# EAGLE design Interface (EAGLE 9.6.2)
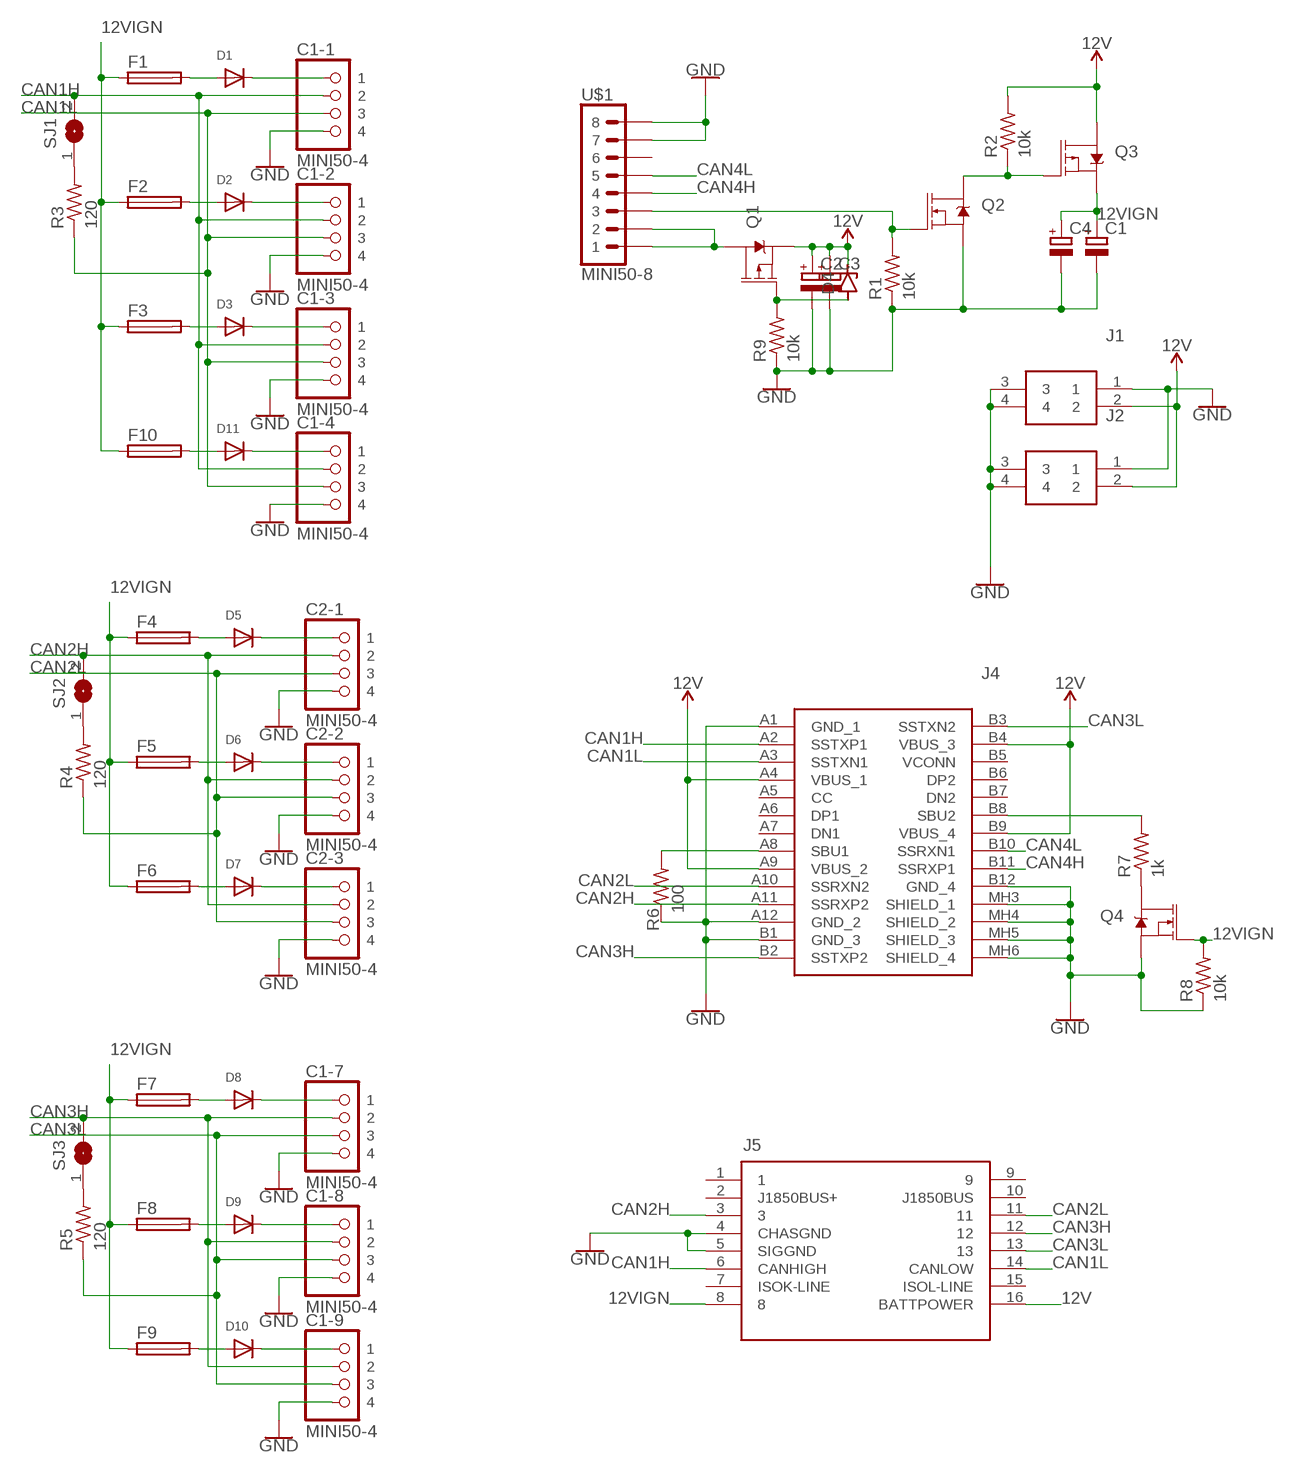
[diagram p0: schematic, sheet 1]

## Parts
C1  CPOL-EU153CLV-1010  [153CLV-1010]
C1-1  MINI50-4  [MINI50]
C1-2  MINI50-4  [MINI50]
C1-3  MINI50-4  [MINI50]
C1-4  MINI50-4  [MINI50]
C1-7  MINI50-4  [MINI50]
C1-8  MINI50-4  [MINI50]
C1-9  MINI50-4  [MINI50]
C2  CPOL-EU153CLV-1010  [153CLV-1010]
C2-1  MINI50-4  [MINI50]
C2-2  MINI50-4  [MINI50]
C2-3  MINI50-4  [MINI50]
C3  CPOL-EU153CLV-0505  [153CLV-0505]
C4  CPOL-EU153CLV-0505  [153CLV-0505]
D1  DIODESOD-323F  [SOD-323F]
D2  DIODESOD-323F  [SOD-323F]
D3  DIODESOD-323F  [SOD-323F]
D4  ZENER_DO-219-AB(SOD123F)  [SODFL3718X115]
D5  DIODESOD-323F  [SOD-323F]
D6  DIODESOD-323F  [SOD-323F]
D7  DIODESOD-323F  [SOD-323F]
D8  DIODESOD-323F  [SOD-323F]
D9  DIODESOD-323F  [SOD-323F]
D10  DIODESOD-323F  [SOD-323F]
D11  DIODESOD-323F  [SOD-323F]
F1  FUSE_CHIP-1206(3216-METRIC)  [FUSC3215X82N]
F2  FUSE_CHIP-1206(3216-METRIC)  [FUSC3215X82N]
F3  FUSE_CHIP-1206(3216-METRIC)  [FUSC3215X82N]
F4  FUSE_CHIP-1206(3216-METRIC)  [FUSC3215X82N]
F5  FUSE_CHIP-1206(3216-METRIC)  [FUSC3215X82N]
F6  FUSE_CHIP-1206(3216-METRIC)  [FUSC3215X82N]
F7  FUSE_CHIP-1206(3216-METRIC)  [FUSC3215X82N]
F8  FUSE_CHIP-1206(3216-METRIC)  [FUSC3215X82N]
F9  FUSE_CHIP-1206(3216-METRIC)  [FUSC3215X82N]
F10  FUSE_CHIP-1206(3216-METRIC)  [FUSC3215X82N]
J1  34912-8020  [0349128020]
J2  34912-8020  [0349128020]
J4  632722110112  [632722110112]
J5  OBDII-FEMALEFEMALE  [OBDII-FEMALE]
Q1  6.5A/20V/35mΩ  MOSFET_PCH-KI4435DY  [SO08]
Q2  5.8A/30V/35mΩ  MOSFET-NCH-AO3404A  [SOT23-3]
Q3  6.5A/20V/35mΩ  MOSFET_PCH-KI4435DY  [SO08]
Q4  5.8A/30V/35mΩ  MOSFET-NCH-AO3404A  [SOT23-3]
R1  10k  R0402  [0402-R]
R2  10k  R0402  [0402-R]
R3  120  R0402  [0402-R]
R4  120  R0402  [0402-R]
R5  120  R0402  [0402-R]
R6  100  R0402  [0402-R]
R7  1k  R0402  [0402-R]
R8  10k  R0402  [0402-R]
R9  10k  R0402  [0402-R]
SJ1  SJ  [SJ]
SJ2  SJ  [SJ]
SJ3  SJ  [SJ]
U$1  MINI50-8  [MINI50-8]

## Nets
12V: C2.+ C3.+ D4.2(C) J1.2 J2.2 J4.A4(VBUS_1) J4.A9(VBUS_2) J4.B4(VBUS_3) J4.B9(VBUS_4) J5.16(BATTPOWER) Q1.1(S) Q1.2(S) Q1.3(S) Q3.5(D) Q3.6(D) Q3.7(D) Q3.8(D) R2.2
12VIGN: C1.+ C4.+ F1.1 F2.1 F3.1 F4.1 F5.1 F6.1 F7.1 F8.1 F9.1 F10.1 J5.8 Q3.1(S) Q3.2(S) Q3.3(S) Q4.1(G) R8.2
CAN1H: C1-1.3 C1-2.3 C1-3.3 C1-4.3 J4.A2(SSTXP1) J5.6(CANHIGH) SJ1.2
CAN1L: C1-1.2 C1-2.2 C1-3.2 C1-4.2 J4.A3(SSTXN1) J5.14(CANLOW) R3.1
CAN2H: C2-1.3 C2-2.3 C2-3.3 J4.A11(SSRXP2) J5.3 SJ2.2
CAN2L: C2-1.2 C2-2.2 C2-3.2 J4.A10(SSRXN2) J5.11 R4.1
CAN3H: C1-7.3 C1-8.3 C1-9.3 J4.B2(SSTXP2) J5.12 SJ3.2
CAN3L: C1-7.2 C1-8.2 C1-9.2 J4.B3(SSTXN2) J5.13 R5.1
CAN4H: J4.B11(SSRXP1) U$1.P$4
CAN4L: J4.B10(SSRXN1) U$1.P$5
GND: C1-1.1 C1-2.1 C1-3.1 C1-4.1 C1-7.1 C1-8.1 C1-9.1 C1.- C2-1.1 C2-2.1 C2-3.1 C2.- C3.- C4.- J1.1 J1.3 J1.4 J2.1 J2.3 J2.4 J4.A1(GND_1) J4.A12(GND_2) J4.B1(GND_3) J4.B12(GND_4) J4.MH3(SHIELD_1) J4.MH4(SHIELD_2) J4.MH5(SHIELD_3) J4.MH6(SHIELD_4) J5.4(CHASGND) J5.5(SIGGND) Q2.2(S) Q4.2(S) R1.1 R6.1 R8.1 R9.1 U$1.P$7 U$1.P$8
N$1: D1.A F1.2
N$2: C1-1.4 D1.C
N$3: D2.A F2.2
N$4: C1-2.4 D2.C
N$5: D3.A F3.2
N$6: C1-3.4 D3.C
N$7: R3.2 SJ1.1
N$8: D5.A F4.2
N$9: C2-1.4 D5.C
N$10: Q1.5(D) Q1.6(D) Q1.7(D) Q1.8(D) U$1.P$1 U$1.P$2
N$11: D6.A F5.2
N$12: Q2.1(G) R1.2 U$1.P$3
N$13: C2-2.4 D6.C
N$14: D7.A F6.2
N$15: Q2.3(D) Q3.4(G) R2.1
N$16: C2-3.4 D7.C
N$17: R4.2 SJ2.1
N$18: D8.A F7.2
N$19: C1-7.4 D8.C
N$20: D9.A F8.2
N$21: C1-8.4 D9.C
N$22: D10.A F9.2
N$23: C1-9.4 D10.C
N$24: R5.2 SJ3.1
N$25: J4.B8(SBU2) R7.2
N$26: D4.1(A) Q1.4(G) R9.2
N$27: D11.A F10.2
N$28: C1-4.4 D11.C
N$29: Q4.3(D) R7.1
N$30: J4.A8(SBU1) R6.2
Unconnected: J4.A5(CC) J4.A6(DP1) J4.A7(DN1) J4.B5(VCONN) J4.B6(DP2) J4.B7(DN2) J5.1 J5.2(J1850BUS+) J5.7(ISOK-LINE) J5.9 J5.10(J1850BUS) J5.15(ISOL-LINE) U$1.P$6

## Library data of the parts
C1-C4 = rcl:CPOL-EU: POLARIZED CAPACITOR, European symbol; SPICEPREFIX: C
C1-1-C1-4 C1-7-C1-9 C2-1-C2-3 = interceptor:MINI50-4
D1-D3 D5-D11 = adafruit:DIODE: Diode SMADIODE - SMA Surface Mount Package 20V 1A Schottky Diode Digikey: 641-1014-6-ND DO-1N4148 - Through Hole Small Current Diode SOD-123 20V 1 A (.5mV Vf) Schottky Diode - Digikey: MBRX120TPMSCT-ND SOD-323 10V 570mA (.38mV Vf, 3ns) Schottky Diode - Digikey: ZLLS410CT-ND SOD-523 30V 30mA Schottky Diode (RB751S-40TE61) - Digikey: RB751S-40TE61CT-ND SOT23-R/W - SOT23 Package (R = Solder Paste/Reflow Ovens, W = Hand-Soldering) BAT54Film 40V 300mA - Digikey: 497-7162-1-ND
D4 = Diode:ZENER: Zener Diode - Generic; CATEGORY: Diode; SUB-CATEGORY: Zener
F1-F10 = Circuit-Protection:FUSE: Fuse - Generic; CATEGORY: Circuit-Protection; SUB-CATEGORY: Fuse
J1 J2 = SamacSys_Parts:34912-8020: Molex Mini50 Series, 34912 Series Number, 1 Row 2 Way Surface Mount Plug PCB Header, with SMT Termination Method Source: Datasheet <https://www.molex.com/pdm_docs/sd/349128020_sd.pdf>; DESCRIPTION: Molex Mini50 Series, 34912 Series Number, 1 Row 2 Way Surface Mount Plug PCB Header, with SMT Termination Method; HEIGHT: 9mm; MANUFACTURER_NAME: Molex; MANUFACTURER_PART_NUMBER: 34912-8020; MOUSER_PART_NUMBER: 538-34912-8020; MOUSER_PRICE-STOCK: https://www.mouser.co.uk/ProductDetail/Molex/34912-8020?qs=jj7GbYRQuObyP9O5PVDUYw%3D%3D
J4 = SamacSys_Parts:632722110112: USB Connectors WR-COM SMT Vertical Black Source: Datasheet; DESCRIPTION: USB Connectors WR-COM SMT Vertical Black; HEIGHT: 7.4mm; MANUFACTURER_NAME: Wurth Elektronik; MANUFACTURER_PART_NUMBER: 632722110112; MOUSER_PART_NUMBER: 710-632722110112; MOUSER_PRICE-STOCK: https://www.mouser.co.uk/ProductDetail/Wurth-Elektronik/632722110112/?qs=2WXlatMagcH6zbfYjgLonA%3D%3D
J5 = interceptor:OBDII-FEMALE
Q1 Q3 = SparkFun-DiscreteSemi:MOSFET_PCH: P-channel MOSFETs Voltage controlled devices that allow control of high current outputs. SparkFun Products: SparkFun ESP32 Thing <https://www.sparkfun.com/products/13907> SparkFun ESP8266 Thing <https://www.sparkfun.com/products/13231>; PROD_ID: TRANS-08355
Q2 Q4 = SparkFun-DiscreteSemi:MOSFET-NCH: N-channel MOSFETs Voltage controlled devices that allow control of high current outputs. SparkFun Products: SparkFun OpenScale <https://www.sparkfun.com/products/13261> SparkFun Digital Sandbox <https://www.sparkfun.com/products/12651> SparkFun Monster Moto Shield <https://www.sparkfun.com/products/10182> SparkFun MOSFET Power Controller <https://www.sparkfun.com/products/11214>; PROD_ID: TRANS-12988
R1-R9 = interceptor:R
SJ1-SJ3 = jumper:SJ: SMD solder JUMPER
U$1 = interceptor:MINI50-8

## Board
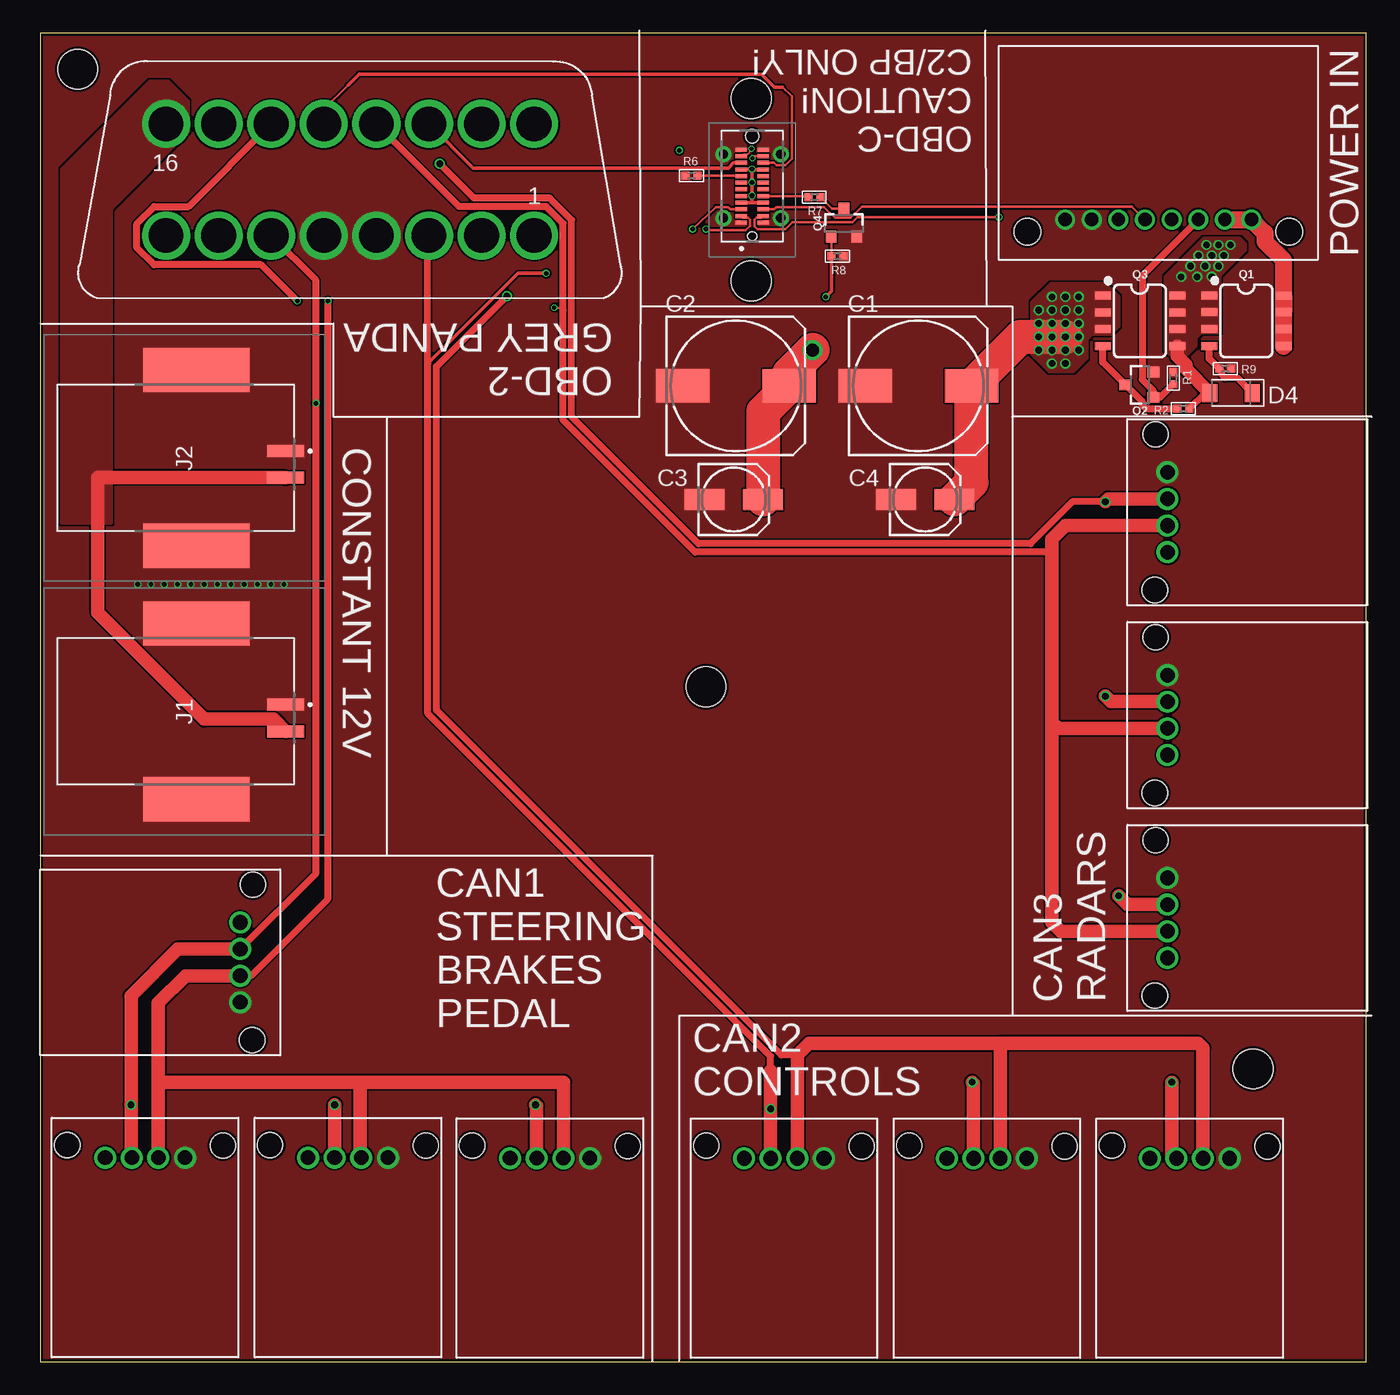
[diagram p1: board, top side]
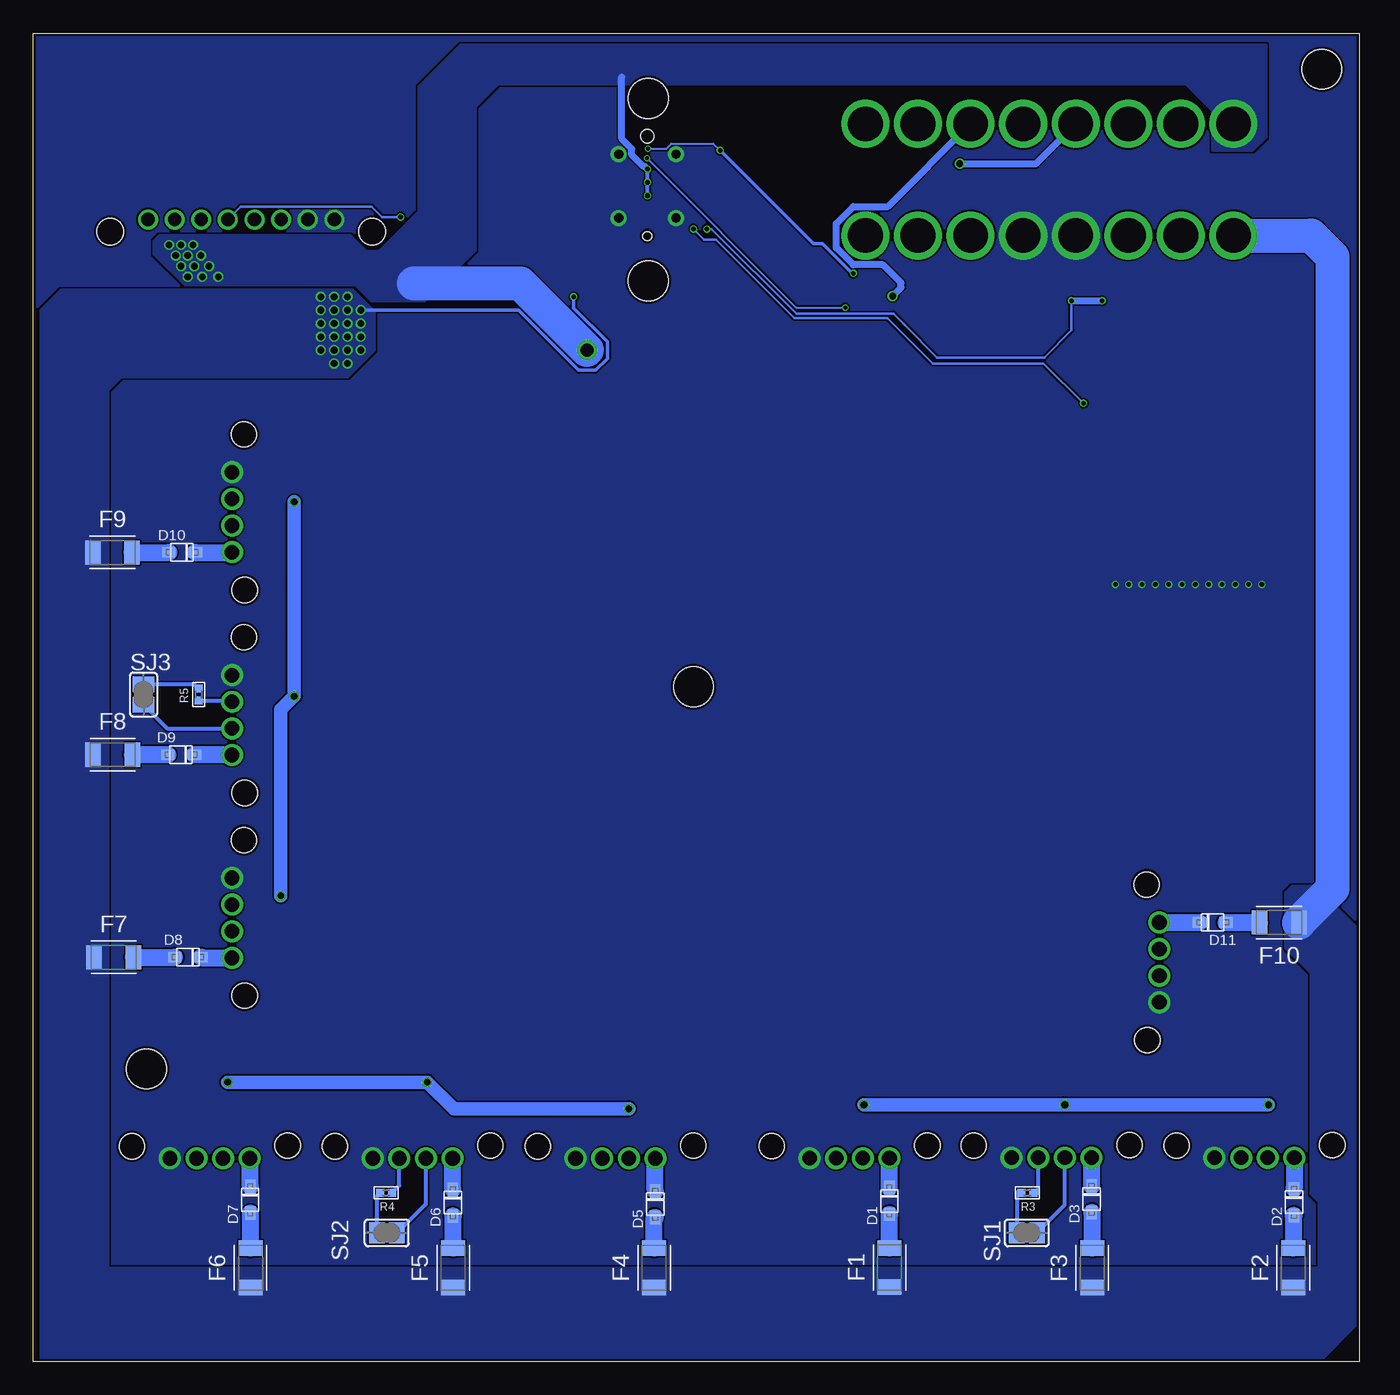
[diagram p2: board, bottom side, seen from below]

Size 99.6 x 99.8 mm. Coordinates in mm from the lower left corner, seen from the top.
Outline: 0,0 99.6,0 99.6,99.8 0,99.8 0,0
Copper layers (1*16): Top 0.035559375mm / dielectric 1.6mm / Bottom 0.035559375mm
Design rules "jlcpcb2layer": minimum track width 5mil, minimum drill 12mil, track to track 5mil, track to pad 5mil, pad to pad 5mil, via to via 5mil, smd to smd 5mil, copper to edge 8mil, drill to drill 6mil, minimum pad ring 5mil, minimum via ring 3mil, stop-mask expansion 2.5mil, vias tented up to drill 0mil, thermal gap 10mil
Holes 3 mm at 53.4,81.2 53.4,94.9 91.1,22 2.8,97.1 50,50.7

### Footprints (pad centres in the part's own frame; a part is rotated, then mirrored left to right if it is on the bottom)
153CLV-1010 = smd 4 x 2.5: + 4,0; - -4,0
MINI50 = drill 1.1: 1 0,0; 2 2,0; 3 4,0; 4 6,0 | hole 1.9: -2.85,-0.9; 8.85,-0.95
153CLV-0505 = smd 3 x 1.6: + 2.2,0; - -2.2,0
SOD-323F = smd 1 x 0.8: A -1,0; C 1,0
SODFL3718X115 = smd 1.115 x 1.361: 1 -1.6,0; 2 1.6,0
FUSC3215X82N = smd 1.165 x 1.814: 1 -1.475,0; 2 1.475,0
0349128020 = smd 0.9 x 2.75: 1 -0.5,6.72; 2 1.5,6.72 | smd 3.32 x 8: 3 -6.59,0; 4 6.61,0
632722110112 = smd 0.3 x 0.85: A1 -2.75,0.83; A2 -2.25,0.83; A3 -1.75,0.83; A4 -1.25,0.83; A5 -0.75,0.83; A6 -0.25,0.83; A7 0.25,0.83; A8 0.75,0.83; A9 1.25,0.83; A10 1.75,0.83; A11 2.25,0.83; A12 2.75,0.83; B1 2.75,-0.83; B2 2.25,-0.83; B3 1.75,-0.83; B4 1.25,-0.83; B5 0.75,-0.83; B6 0.25,-0.83; B7 -0.25,-0.83; B8 -0.75,-0.83; B9 -1.25,-0.83; B10 -1.75,-0.83; B11 -2.25,-0.83; B12 -2.75,-0.83 | drill 0.7 pad 1.2: MH3 -2.4,2.15; MH4 2.4,2.15; MH5 -2.4,-2.15; MH6 2.4,-2.15 | hole 0.66: -3.75,0 | hole 1: 3.75,0
OBDII-FEMALE = drill 2.6 pad 3.4: 1 13.825,-4.2; 2 9.875,-4.2; 3 5.925,-4.2; 4 1.975,-4.2; 5 -1.975,-4.2; 6 -5.925,-4.2; 7 -9.875,-4.2; 8 -13.825,-4.2; 9 13.825,4.2; 10 9.875,4.2; 11 5.925,4.2; 12 1.975,4.2; 13 -1.975,4.2; 14 -5.925,4.2; 15 -9.875,4.2; 16 -13.825,4.2
SO08 = smd 0.6 x 1.2: 1 -1.905,-2.8; 2 -0.635,-2.8; 3 0.635,-2.8; 4 1.905,-2.8; 5 1.905,2.8; 6 0.635,2.8; 7 -0.635,2.8; 8 -1.905,2.8
SOT23-3 = smd 0.8 x 0.9: 1 -0.95,-1; 2 0.95,-1; 3 0,1.1
0402-R = smd 0.6 x 0.6: 1 -0.45,0; 2 0.45,0
SJ = smd 1.168 x 1.6: 1 -0.762,0; 2 0.762,0
MINI50-8 = drill 1: P$1 0,0; P$2 2,0; P$3 4,0; P$4 6,0; P$5 8,0; P$6 10,0; P$7 12,0; P$8 14,0 | hole 2: -2.85,0.9; 16.85,0.9

### Placement (x,y rotation side)
C1  65.95,73.31 0 top
C1-1  41.28,15.29 180 top
C1-2  10.86,15.33 180 top
C1-3  26.1,15.33 180 top
C1-4  15,27 90 top
C1-7  84.67,36.34 270 top
C1-8  84.67,51.58 270 top
C1-9  84.67,66.82 270 top
C2  52.25,73.31 0 top
C2-1  58.86,15.28 180 top
C2-2  74.1,15.28 180 top
C2-3  89.34,15.28 180 top
C3  52.09,64.77 0 top
C4  66.47,64.77 0 top
D1  35.28,12.07 90 bottom
D2  4.88,11.99 90 bottom
D3  20.08,12.21 90 bottom
D4  89.45,72.78 180 top
D5  52.88,11.83 90 bottom
D6  68.08,11.95 90 bottom
D7  83.3,12.16 90 bottom
D8  87.98,30.4 0 bottom
D9  88.5,45.6 0 bottom
D10  88.42,60.8 0 bottom
D11  11,33 180 bottom
F1  35.27,7.08 90 bottom
F2  4.94,7.06 90 bottom
F3  20.04,7.05 90 bottom
F4  52.96,7.06 90 bottom
F5  68.06,7.05 90 bottom
F6  83.28,7.06 90 bottom
F7  93.55,30.38 0 bottom
F8  93.64,45.6 0 bottom
F9  93.65,60.8 0 bottom
F10  6,33 180 bottom
J1  11.7,48.86 270 top
J2  11.7,67.91 270 top
J4  53.47,88.32 90 top
J5  23.26,88.8 0 top
Q1  90.6,78.2 270 top
Q2  82.6,73.39 90 top
Q3  82.6,78.19 270 top
Q4  60.36,85.52 0 top
R1  85.1,73.89 270 top
R2  85.87,71.6 0 top
R3  24.93,12.7 180 bottom
R4  73.09,12.7 180 bottom
R5  87.19,50.11 90 bottom
R6  48.91,89.1 0 top
R7  58.13,87.5 180 top
R8  59.89,83.05 180 top
R9  89,74.6 180 top
SJ1  24.96,9.68 0 bottom
SJ2  73.04,9.68 0 bottom
SJ3  91.32,50.12 270 bottom
U$1  90.98,85.81 180 top

### Tracks (layer width: path | path; a pad name or v marks a point on that pad's centre or on a via)
12V  (via drill 0.35, 0.5, 1)
  Top 0.254: J4.B9 53.4,87.07 | 53.4,87.07 J4.A4 | J4.A9 52.67,89.6 v53.45,89.6 | J4.B4 53.48,89.57 v53.45,89.6 | v53.45,89.6 53.45,87.12 53.4,87.07
  Top 0.508: R2.2 87.5,72.78 D4.2
  Top 1.016: J2.2 4.31,66.41 4.31,56.28 12.32,48.27 17.5,48.27 J1.2 | D4.2 86.03,74.59 86.03,74.9 85.4,75.54 Q3.5
  Top 2.54: C3.+ 54.29,71.35 C2.+ 56.25,74.25 v58,76
  Bottom 0.305: v53.45,87.6 v53.45,88.6 v53.45,89.6
  Bottom 0.508: v53.45,89.6 53.65,89.79 53.75,89.79 54.64,90.68 54.64,91.13 55.4,91.89 55.4,96.5
  Bottom 2.54: v58,76 63,81 71,81
  other vias: 87.6,83.9 88.5,83.9 89.4,83.9 87,83.1 88,83.1 88.9,83.1 86.4,82.3 87.5,82.3 88.5,82.3 85.7,81.5 86.9,81.5 88,81.5
  pour Top (no thermals): 87,84 84.5,81.5 84.5,76 84.8,75.7 86.2,75.7 86.8,76.3 86.8,76.9 87.2,77.3 88.6,77.3 88.6,81.6 90.5,83.5 90.5,84 90.1,84.4 87.4,84.4
  pour Bottom (no thermals): 75.4,80.9 74.2,79.7 70.2,79.7 66.4,83.5 66.4,94.3 64.7,96 7,96 7,98.9 67.5,98.9 70.6,95.8 70.6,86.4 73.6,83.4 74.6,83.4 75.8,84.6 90.1,84.6 90.5,84.2 90.5,83.2 88.2,80.9
  pour Top (no thermals): 1.6,63 5.3,63 5.3,86.6 11.1,92.4 11.1,94.7 9.6,96.2 8.2,96.2 1.6,89.6
  pour Bottom (no thermals): 13,96 11,94 11,91 8,91 7,92 7,96
12VIGN  (via drill 0.35, 0.5)
  Top 0.203: R8.2 59.44,84.49 Q4.1
  Top 0.254: R8.2 59.44,80.44 v59,80
  Top 2.54: C4.+ 69.95,66.05 C1.+ 73.64,77 v77,77
  Bottom 0.254: v75,79 63.16,79 58.63,74.48 57.37,74.48 56.48,75.37 56.48,76.63 59,79.16 v59,80
  Bottom 2.54: J5.8 3.6,84.6 2,83 2,35.52 F10.1
  other vias: 78,80 77,80 76,80 76,79 77,79 78,79 78,78 77,78 76,78 75,78 75,77 76,77 78,77 78,76 77,76 76,76 75,76 76,75 77,75
  pour Top (no thermals): 81,80 80,81 75.9,81 74.5,79.6 74.5,75.7 75.8,74.4 77.6,74.4 78.6,75.4 78.6,76.8 79,77.2 80.4,77.2 81,77.8
  pour Bottom (no thermals): 99,3 99,79 97.5,80.5 75.6,80.5 74,78.9 74,76 76,74 93,74 94,73 94,3
  pour Bottom (no thermals): 99,0 99,7 3,7 3,0
  pour Bottom (no thermals): 3,0 3,12 3.6,12.6 3.6,29.2 5.5,31.1 5.5,35.2 5,35.7 3.3,35.7 0.2,32.6 0.2,2.8
CAN1H  (via drill 0.35, 0.5)
  Top 0.203: J4.A2 52.76,85.95 53.16,85.95 53.29,85.81 53.29,85.33 52.97,85 50.1,85 v50,85.1
  Top 0.508: C1-4.3 20.7,36.7 v20.7,72 20.7,81.23 J5.6
  Top 1.016: C1-4.3 10.3,31 6.8,27.5 v6.8,19.3 6.8,15.39 C1-2.3 | C1-3.3 v22.1,19.3 | C1-1.3 37.28,19.22 v37.2,19.3
  Bottom 0.203: v20.7,72 23.7,75 32,75 35.41,78.41 42.41,78.41 48.3,84.3 49.2,84.3 v50,85.1
  Bottom 0.305: SJ1.2 22.1,11.78 C1-3.3
  Bottom 1.016: v6.8,19.3 v22.1,19.3 v37.2,19.3
CAN1L  (via drill 0.35)
  Top 0.203: J4.A3 51.84,86.57 51.66,86.75 50.75,86.75 v49,85.1
  Top 0.508: C1-4.2 15.83,29 21.6,34.77 v21.6,79.7 | v19.3,79.7 16.59,82.41 8.53,82.41 7.25,83.69 7.25,85.51 8.53,86.79 11.12,86.79 J5.14
  Top 1.016: C1-4.2 10.9,29 8.86,26.96 8.86,21 | 8.86,21 C1-2.2 | C1-3.2 24,15.43 24,21 | 24,21 8.86,21 | C1-1.2 39.28,20.98 39.3,21 24,21
  Bottom 0.203: v21.6,79.7 21.6,77.5 23.65,75.45 31.7,75.45 34.12,77.88 34.24,78 34.99,78.74 42.27,78.74 48.63,85.1 v49,85.1
  Bottom 0.305: R3.1 24.1,12.7 C1-3.2
  Bottom 0.508: v21.6,79.7 v19.3,79.7
CAN2H  (via drill 0.3, 0.35, 0.5)
  Top 0.127: J4.A11 52.8,90.73 53.14,90.73 53.26,90.84 53.26,90.97 v53.42,91.14
  Top 0.254: 29.1,75 35.87,81.77 v38,81.77
  Top 0.508: 54.86,21.86 54.86,22.94 29.1,48.7 29.1,75 29.1,84.52 J5.3
  Top 1.016: 54.86,21.86 v54.86,19 C2-1.3 | C2-3.3 85,15.62 v85,21 | C2-2.3 70.1,20.9 v70,21
  Bottom 0.15: v53.42,91.14 52.04,91.14 51.65,91.52 48.52,91.52 v48,91
  Bottom 0.254: v38,81.77 38.14,81.9 38.2,81.9 40.3,84 41,84 v48,91
  Bottom 0.305: SJ2.2 70.1,11.86 C2-2.3
  Bottom 1.016: v85,21 v70,21 68,19 v54.86,19
CAN2L  (via drill 0.5)
  Top 0.254: J4.A10 52.08,90.07 51.67,89.67 32.52,89.67 J5.11
  Top 0.508: 56.86,23.04 55.66,23.04 29.75,48.95 29.75,74.76 v35.05,80.06
  Top 1.016: C2-1.2 56.86,23.04 57.72,23.9 72,23.9 | 72,23.9 72.1,23.8 C2-2.2 | C2-3.2 87.34,23.56 87,23.9 72,23.9
  Bottom 0.305: R4.1 72.1,13.24 C2-2.2
  Bottom 0.508: J5.11 35.4,86.79 37.99,86.79 39.27,85.51 39.27,83.69 37.99,82.41 35.76,82.41 34.4,81.06 34.4,80.7 v35.05,80.06
CAN3H  (via drill 0.3)
  Top 0.15: J4.B2 53.67,90.57 v53.5,90.4 | v38.6,79.2 39.07,79.2 39.27,79
  Top 0.508: 76,60.82 49.18,60.82 39.27,70.73 39.27,79 39.27,85.51 37.99,86.79 31.45,86.79 J5.12
  Top 1.016: C1-7.3 76.66,32.34 76,33 76,48 | 76,48 76,60.82 76,61.82 77,62.82 C1-9.3 | C1-8.3 76.42,47.58 76,48
  Bottom 0.15: v53.5,90.4 42.3,79.2 v38.6,79.2
  Bottom 0.305: SJ3.2 89.54,47.58 C1-8.3
CAN3L  (via drill 0.5)
  Top 0.203: J4.B3 55.1,90.07 55.28,89.89 55.96,89.89 56.45,90.38 56.45,95.06 55.76,95.76 | 23.1,95.9 21.29,94.08 J5.13
  Top 0.254: 55.76,95.76 55.13,95.76 54.16,96.73 23.93,96.73 23.1,95.9
  Top 0.508: v80,64.6 77.52,64.6 74.38,61.45 49.45,61.45 39.91,71 39.91,85.77 38.26,87.42 32.58,87.42 v30,90
  Top 1.016: C1-7.2 81.66,34.34 v81,35 | v80,64.6 80.22,64.82 C1-9.2 | C1-8.2 80.42,49.58 v80,50
  Bottom 0.305: R5.1 84.75,49.66 C1-8.2
  Bottom 0.508: v30,90 24.29,90 J5.13
  Bottom 1.016: v81,35 81,49 v80,50 v80,64.6
CAN4H  (via drill 0.35)
  Top 0.203: v72,86 61.38,86 60.99,85.61 56.48,85.61 55.96,85.09 53.88,85.09 53.65,85.33 53.65,85.81 53.78,85.95 54.18,85.95 J4.B11
  Bottom 0.203: v72,86 73.38,86 74.16,86.79 84,86.79 U$1.P$4
CAN4L
  Top 0.203: J4.B10 55.1,86.57 55.28,86.75 58.86,86.75 59.67,85.94 60.85,85.94 61.7,86.79 82,86.79 U$1.P$5
GND  (via drill 0.35)
  other vias: 8.3,58.4 9.3,58.4 10.3,58.4 11.3,58.4 12.3,58.4 13.3,58.4 14.3,58.4 15.3,58.4 16.3,58.4 17.3,58.4 18.3,58.4 7.3,58.4
  pour Top (rank 2, no thermals): 0,0 99.6,0 99.6,99.8 0,99.8
  pour Bottom (rank 2, no thermals): 0,0 99.6,0 99.6,99.8 0,99.8
N$1
  Bottom 1.27: F1.2 D1.A
N$2
  Bottom 1.27: D1.C C1-1.4
N$3
  Bottom 1.27: D2.A 4.94,10.99 F2.2
N$4
  Bottom 1.27: C1-2.4 4.88,15.33 D2.C
N$5
  Bottom 1.27: F3.2 20.04,11.21 D3.A
N$6
  Bottom 1.27: C1-3.4 20.1,13.21 D3.C
N$7
  Bottom 0.305: R3.2 25.72,12.7 SJ1.1
N$8
  Bottom 1.27: F4.2 52.96,10.83 D5.A
N$9
  Bottom 1.27: D5.C 52.88,15.28 C2-1.4
N$10
  Top 1.27: U$1.P$2 U$1.P$1 91.99,84.8 91.99,84.15 93.4,82.74 Q1.7 | Q1.5 Q1.6 Q1.7 | Q1.8 Q1.7
N$11
  Bottom 1.27: F5.2 68.06,10.95 D6.A
N$12
  Top 0.508: U$1.P$3 82.77,81.6 82.77,73.78 83.6,72.95 Q2.1 84.1,72.44 R1.2
N$13
  Bottom 1.27: D6.C 68.08,15.28 C2-2.4
N$14
  Bottom 1.27: F6.2 83.28,11.16 D7.A
N$15
  Top 0.508: R2.1 83.05,71.6 82.77,71.88 82.77,72.12 Q2.3 79.8,75.09 Q3.4
N$16
  Bottom 1.27: D7.C 83.3,15.28 C2-3.4
N$17
  Bottom 0.305: R4.2 73.8,12.44 SJ2.1
N$18
  Bottom 1.27: F7.2 88.98,30.38 D8.A
N$19
  Bottom 1.27: D8.C 86.98,30.34 C1-7.4
N$20
  Bottom 1.27: F8.2 D9.A
N$21
  Bottom 1.27: D9.C 84.67,45.6 C1-8.4
N$22
  Bottom 1.27: F9.2 D10.A
N$23
  Bottom 1.27: D10.C 84.67,60.8 C1-9.4
N$24
  Bottom 0.305: R5.2 87.51,50.88 SJ3.1
N$25
  Top 0.203: J4.B8 57.61,87.57 R7.2
N$26
  Top 0.508: Q1.4 87.8,75.35 R9.2 88.77,74.38 88.77,74.14 88.99,73.92 89.91,73.92 D4.1
N$27
  Bottom 1.27: D11.A F10.2
N$28
  Bottom 1.27: C1-4.4 D11.C
N$29
  Top 0.203: R7.1 59.46,86.62 Q4.3
N$30
  Top 0.203: R6.2 52.61,89.1 J4.A8

### Text on the board
tNames: OBD-C / CAUTION! / C2/BP ONLY! | POWER IN | OBD-2 / GREY PANDA | CONSTANT 12V | CAN3 / RADARS | CAN1 / STEERING / BRAKES / PEDAL | CAN2 / CONTROLS